# EAGLE design pena (EAGLE 7.7.0)
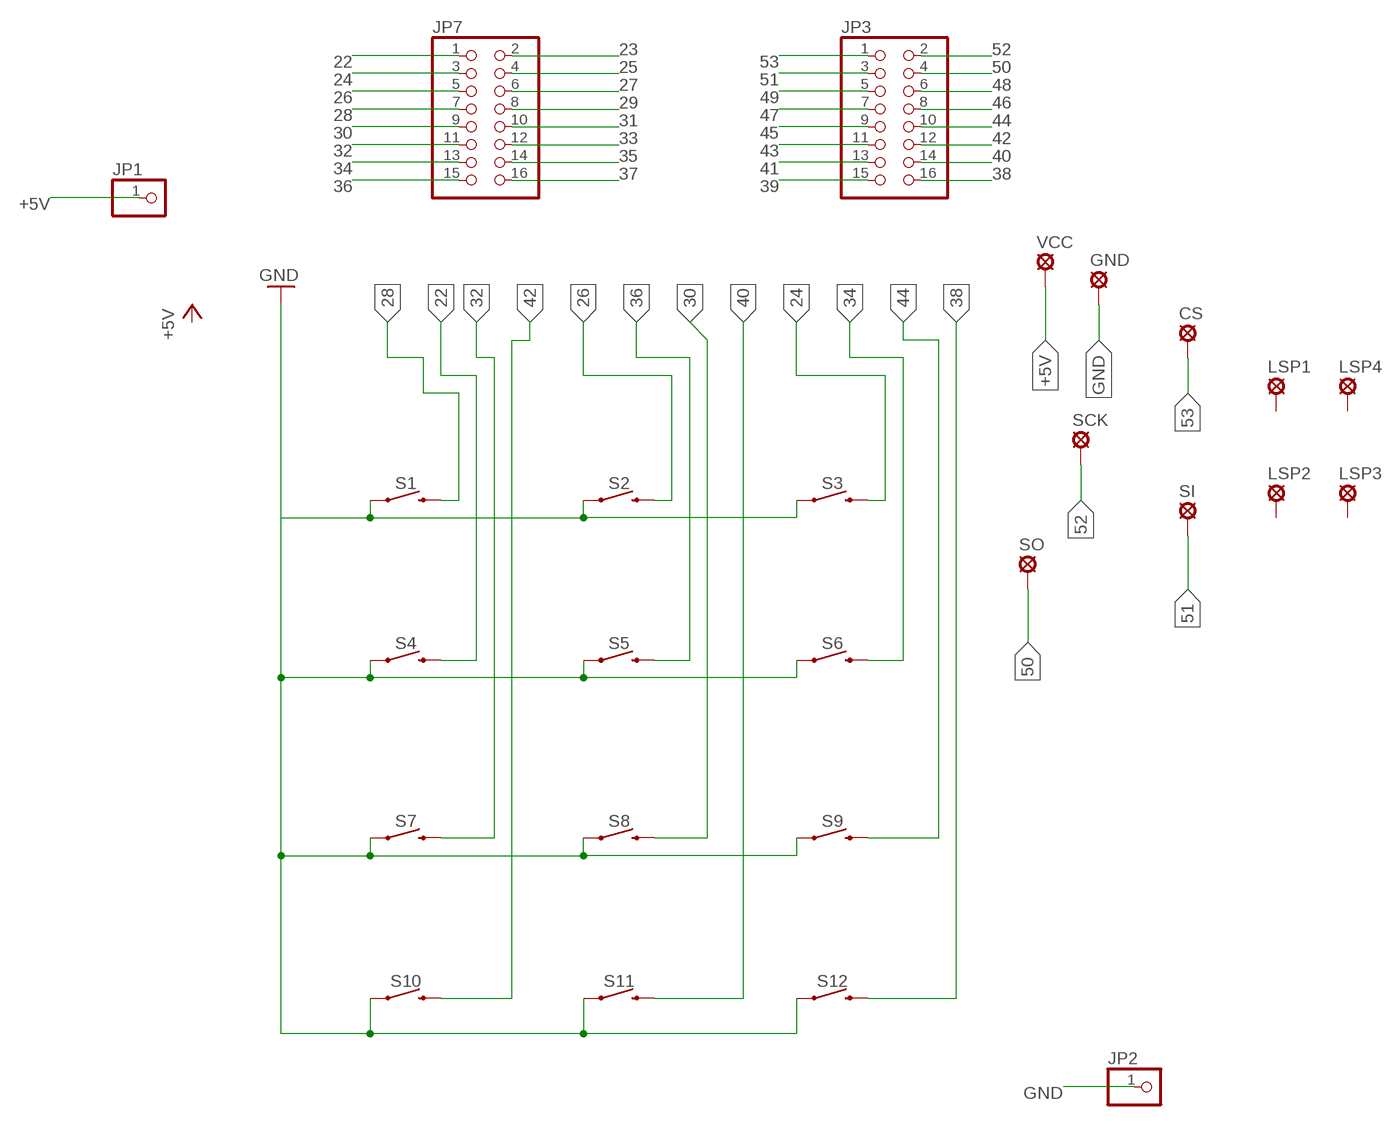
[diagram p0: schematic, sheet 1]

## Parts
CS  SE11  [SE11]
GND  SE11  [SE11]
JP1  PINHD-1X1  [1X01]
JP2  PINHD-1X1  [1X01]
JP3  PINHD-2X8  [2X08]
JP7  PINHD-2X8  [2X08]
LSP1  SE11  [SE11]
LSP2  SE11  [SE11]
LSP3  SE11  [SE11]
LSP4  SE11  [SE11]
S1  MOMENTARY-SWITCH-SPST-PTH-12MM  [TACTILE_SWITCH_PTH_12MM]
S2  MOMENTARY-SWITCH-SPST-PTH-12MM  [TACTILE_SWITCH_PTH_12MM]
S3  MOMENTARY-SWITCH-SPST-PTH-12MM  [TACTILE_SWITCH_PTH_12MM]
S4  MOMENTARY-SWITCH-SPST-PTH-12MM  [TACTILE_SWITCH_PTH_12MM]
S5  MOMENTARY-SWITCH-SPST-PTH-12MM  [TACTILE_SWITCH_PTH_12MM]
S6  MOMENTARY-SWITCH-SPST-PTH-12MM  [TACTILE_SWITCH_PTH_12MM]
S7  MOMENTARY-SWITCH-SPST-PTH-12MM  [TACTILE_SWITCH_PTH_12MM]
S8  MOMENTARY-SWITCH-SPST-PTH-12MM  [TACTILE_SWITCH_PTH_12MM]
S9  MOMENTARY-SWITCH-SPST-PTH-12MM  [TACTILE_SWITCH_PTH_12MM]
S10  MOMENTARY-SWITCH-SPST-PTH-12MM  [TACTILE_SWITCH_PTH_12MM]
S11  MOMENTARY-SWITCH-SPST-PTH-12MM  [TACTILE_SWITCH_PTH_12MM]
S12  MOMENTARY-SWITCH-SPST-PTH-12MM  [TACTILE_SWITCH_PTH_12MM]
SCK  SE11  [SE11]
SI  SE11  [SE11]
SO  SE11  [SE11]
VCC  SE11  [SE11]

## Nets
22: JP7.1 S4.3
23: JP7.2
24: JP7.3 S3.3
25: JP7.4
26: JP7.5 S2.3
27: JP7.6
28: JP7.7 S1.3
29: JP7.8
30: JP7.9 S8.3
31: JP7.10
32: JP7.11 S7.3
33: JP7.12
34: JP7.13 S6.3
35: JP7.14
36: JP7.15 S5.3
37: JP7.16
38: JP3.16 S12.3
39: JP3.15
40: JP3.14 S11.3
41: JP3.13
42: JP3.12 S10.3
43: JP3.11
44: JP3.10 S9.3
45: JP3.9
46: JP3.8
47: JP3.7
48: JP3.6
49: JP3.5
50: JP3.4 SO.MP
51: JP3.3 SI.MP
52: JP3.2 SCK.MP
53: CS.MP JP3.1
+5V: JP1.1 VCC.MP
GND: GND.MP JP2.1 S1.1 S2.1 S3.1 S4.1 S5.1 S6.1 S7.1 S8.1 S9.1 S10.1 S11.1 S12.1
Unconnected: LSP1.MP LSP2.MP LSP3.MP LSP4.MP

## Library data of the parts
CS GND LSP1-LSP4 SCK SI SO VCC = solpad:SE11: SOLDER PAD RTM, drill 1,1mm, distributor Buerklin, 07F810
JP1 JP2 = mega:PINHD-1X1: PIN HEADER
JP3 JP7 = mega:PINHD-2X8: PIN HEADER
S1-S12 = SparkFun-Switches:MOMENTARY-SWITCH-SPST: Momentary Switch (Pushbutton) - SPST Normally-open (NO) SPST momentary switches (buttons, pushbuttons). Variants PTH-12MM - 12mm square, through-hole Momentary Pushbutton Switch - 12mm Square <https://www.sparkfun.com/products/9190> (COM-09190) PTH-6.0MM, PTH-6.0MM-KIT - 6.0mm square, through-hole Mini Pushbutton Switch <https://www.sparkfun.com/products/97> (COM-00097) KIT package intended for soldering kit's - only one side of pads' copper is exposed. PTH-RIGHT-ANGLE-KIT - Right-angle, through-hole Right Angle Tactile Button <https://www.sparkfun.com/products/10791> - Used on SparkFun BigTime Watch Kit <https://www.sparkfun.com/products/11734> SMD-12MM - 12mm square, surface-mount Tactile Button - SMD (12mm) <https://www.sparkfun.com/products/12993> (COM-12993) Used on SparkFun PicoBoard <https://www.sparkfun.com/products/11888> SMD-4.5MM - 4.5mm Square Trackball Switch Used on SparkFun Blackberry Trackballer Breakout <https://www.sparkfun.com/products/13169> SMD-4.6MMX2.8MM - 4.60mm x 2.80mm, surface mount Used on SparkFun SAMD21 Mini Breakout <https://www.sparkfun.com/products/13664> SMD-5.2MM, SMD-5.2-REDUNDANT - 5.2mm square, surface-mount Mini Pushbutton Switch - SMD <https://www.sparkfun.com/products/8720> (COM-08720) Used on Arduino Pro Mini <https://www.sparkfun.com/products/11114> REDUNDANT package connects both switch circuits together SMD-6.0X3.5MM - 6.0 x 3.5mm, surface mount Momentary Reset Switch SMD <https://www.sparkfun.com/products/8229> (COM-08229) SMD-6.2MM-TALL - 6.2mm square, surface mount Tactile Button - SMD (6mm) <https://www.sparkfun.com/products/12992> Used on SparkFun Digital Sandbox <https://www.sparkfun.com/products/12651> SMD-RIGHT-ANGLE - Right-angle, surface mount Used on SparkFun Block for Intel® Edison - Arduino <https://www.sparkfun.com/products/13036>; PROD_ID: SWCH-09185; SF_SKU: COM-09190

## Net classes
0 default: width 1 mm, drill 0.635 mm, clearance 0.25 mm
1 power: width 0.61 mm, drill 0.711 mm, clearance 0.203 mm
2 gnd: width 0.305 mm, drill 0.711 mm, clearance 0.203 mm
3 usbvcc: width 0.508 mm, drill 0.711 mm, clearance 0.203 mm

## Board
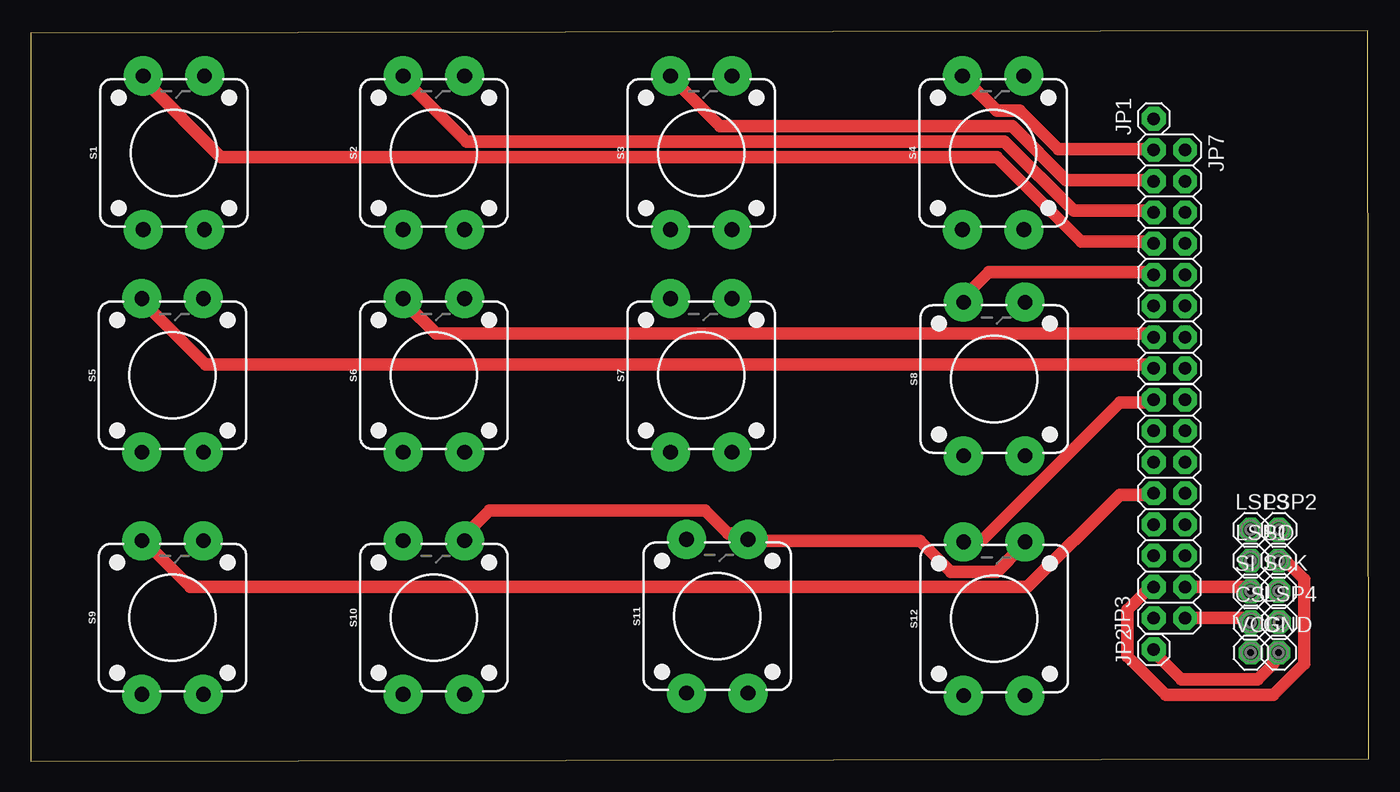
[diagram p1: board, top side]
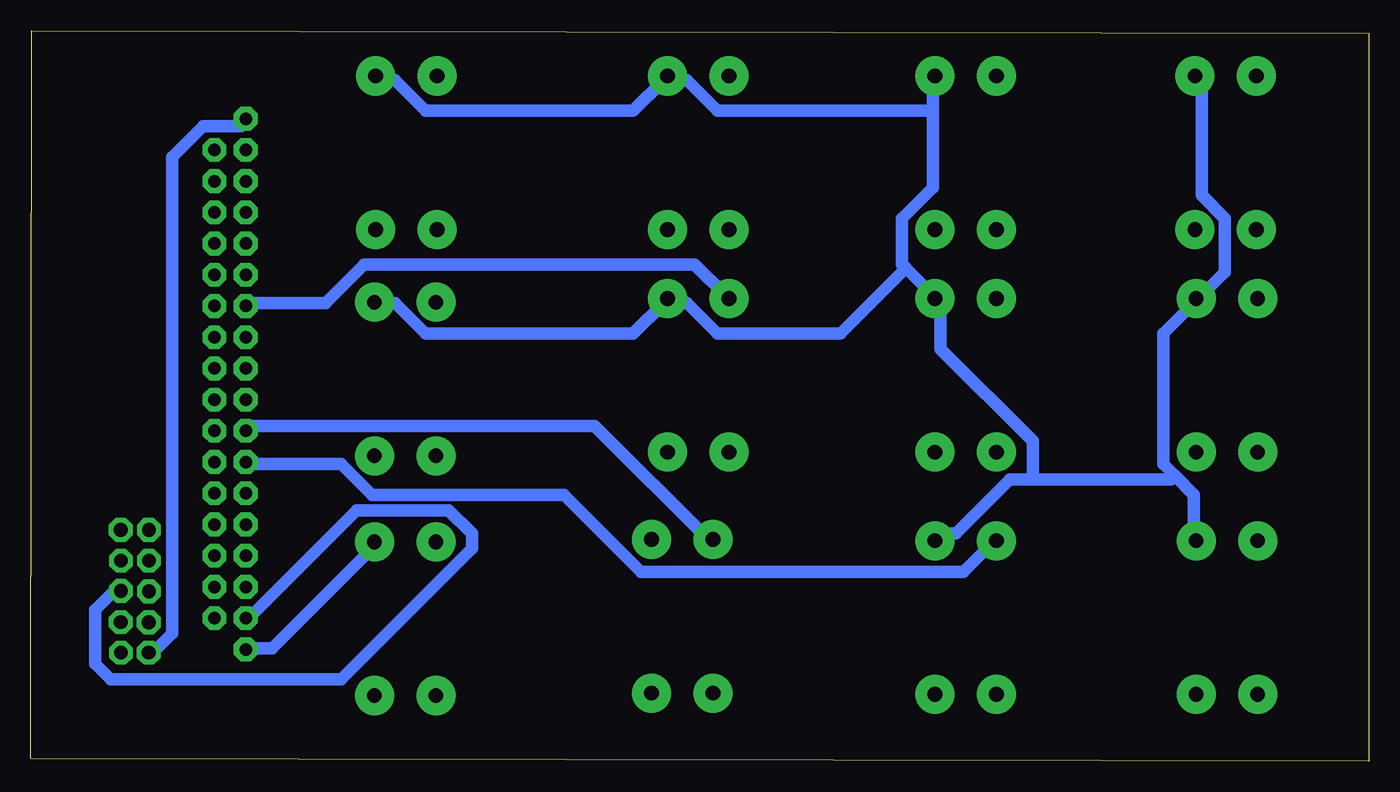
[diagram p2: board, bottom side, seen from below]

Size 108.85 x 59.44 mm. Coordinates in mm from the lower left corner, seen from the top.
Outline: 0,0 108.85,0.2 108.75,59.44 0,59.24 0,0
Copper layers (1*16): Top 0.035mm / dielectric 1.5mm / Bottom 0.035mm
Design rules "default": minimum track width 10mil, minimum drill 24mil, track to track 8mil, track to pad 8mil, pad to pad 8mil, via to via 8mil, smd to smd 8mil, copper to edge 40mil, drill to drill 8mil, minimum pad ring 10mil, minimum via ring 8mil, stop-mask expansion 4mil, vias tented up to drill 0mil, thermal gap 10mil

### Footprints (pad centres in the part's own frame; a part is rotated, then mirrored left to right if it is on the bottom)
SE11 = drill 1.118 pad 1.93 octagon: MP 0,0
1X01 = drill 1.016 pad 1.93 octagon: 1 0,0
2X08 = drill 1.016 pad 1.93 octagon: 1 -8.89,-1.27; 2 -8.89,1.27; 3 -6.35,-1.27; 4 -6.35,1.27; 5 -3.81,-1.27; 6 -3.81,1.27; 7 -1.27,-1.27; 8 -1.27,1.27; 9 1.27,-1.27; 10 1.27,1.27; 11 3.81,-1.27; 12 3.81,1.27; 13 6.35,-1.27; 14 6.35,1.27; 15 8.89,-1.27; 16 8.89,1.27
TACTILE_SWITCH_PTH_12MM = drill 1.2 pad 3.175: 1 6.25,-2.5; 2 -6.25,-2.5; 3 6.25,2.5; 4 -6.25,2.5

### Placement (x,y rotation side)
CS  99.25,11.29 0 top
GND  101.51,8.83 0 top
JP1  91.36,52.28 90 top
JP2  91.36,9.1 90 top
JP3  92.63,20.53 90 top
JP7  92.63,40.85 270 top
LSP1  99.24,16.32 0 top
LSP2  101.54,18.82 0 top
LSP3  99.24,18.82 0 top
LSP4  101.54,11.32 0 top
S1  11.64,49.51 90 top
S2  32.79,49.51 90 top
S3  54.54,49.51 90 top
S4  78.29,49.51 90 top
S5  11.54,31.4 90 top
S6  32.79,31.4 90 top
S7  54.54,31.4 90 top
S8  78.39,31.1 90 top
S9  11.54,11.69 90 top
S10  32.79,11.69 90 top
S11  55.84,11.79 90 top
S12  78.39,11.59 90 top
SCK  101.51,13.85 0 top
SI  99.24,13.82 0 top
SO  101.51,16.31 0 top
VCC  99.25,8.83 0 top

### Tracks (layer width: path | path; a pad name or v marks a point on that pad's centre or on a via)
22
  Top 1: JP7.1 91.09,49.8 83.59,49.8 80.47,52.92 78.59,52.92 76.09,55.42 S4.3
24
  Top 1: JP7.3 91.09,47.3 84.22,47.3 79.84,51.67 56.09,51.67 52.34,55.42 S3.3
26
  Top 1: JP7.5 91.09,44.8 84.84,44.8 79.22,50.42 35.47,50.42 30.46,55.42 S2.3
28
  Top 1: JP7.7 91.09,42.3 85.47,42.3 78.59,49.17 15.46,49.17 9.21,55.42 S1.3
30
  Top 1: JP7.9 91.09,39.8 77.97,39.8 76.09,37.92 S8.3
32
  Bottom 1: JP7.11 91.09,37.3 84.84,37.3 81.72,40.42 54.84,40.42 52.34,37.92 S7.3
34
  Top 1: JP7.13 91.09,34.8 32.97,34.8 30.46,37.3 S6.3
36
  Top 1: JP7.15 91.09,32.3 14.21,32.3 9.21,37.3 S5.3
38
  Top 1: JP3.16 91.09,29.17 88.59,29.17 77.34,17.92 76.09,17.92 S12.3
40
  Bottom 1: JP3.14 91.09,27.3 62.97,27.3 53.59,17.92 S11.3
42
  Bottom 1: JP3.12 91.09,24.17 83.59,24.17 81.09,21.67 65.47,21.67 59.22,15.42 32.97,15.42 30.46,17.92 S10.3
44
  Top 1: JP3.10 91.09,21.67 88.59,21.67 81.09,14.17 12.96,14.17 9.21,17.92 S9.3
50
  Top 1: JP3.4 91.09,14.17 89.22,12.3 89.22,8.55 92.34,5.42 101.09,5.42 103.59,7.92 103.59,14.8 101.72,16.67 SO.MP
51
  Top 1: SI.MP 99.22,14.17 94.22,14.17 JP3.3
52
  Bottom 1: JP3.2 91.09,11.67 82.34,20.42 74.84,20.42 72.97,18.55 72.97,17.3 83.59,6.67 102.34,6.67 103.59,7.92 103.59,12.3 101.72,14.17 SCK.MP
53
  Top 1: CS.MP 99.22,11.67 94.22,11.67 JP3.1
+5V
  Bottom 1: JP1.1 91.72,51.67 94.84,51.67 97.34,49.17 97.34,10.42 99.22,8.55 VCC.MP
GND
  Top 1: GND.MP 101.09,8.55 101.09,7.92 99.84,6.67 93.59,6.67 91.72,8.55 JP2.1 | S12.1 80.47,17.3 78.59,15.42 74.84,15.42 72.34,17.92 58.59,17.92 S11.1 57.97,18.55 56.72,18.55 54.84,20.42 37.34,20.42 35.47,18.55 S10.1
  Bottom 1: JP2.1 91.09,9.17 89.22,9.17 81.09,17.3 S12.1 | 15.78,23.23 16.71,24.17 16.71,34.8 14.21,37.3 S5.1 13.59,37.92 11.71,39.8 11.71,44.17 13.59,46.05 13.59,55.42 S1.1 | 15.78,23.23 14.21,21.67 14.21,18.55 S9.1 | 27.34,22.92 16.09,22.92 15.78,23.23 | 27.34,22.92 29.21,22.92 33.59,18.55 34.84,18.55 S10.1 | 27.34,22.92 27.34,26.05 34.84,33.55 34.84,37.3 S6.1 35.47,37.92 37.65,40.11 | 35.47,52.92 35.47,46.67 37.97,44.17 37.97,40.42 37.65,40.11 | 35.47,52.92 35.47,55.42 S2.1 | 37.65,40.11 42.97,34.8 52.97,34.8 55.47,37.3 56.72,37.3 S7.1 57.34,37.3 59.84,34.8 76.72,34.8 79.22,37.3 80.47,37.3 S8.1 | 35.47,52.92 52.97,52.92 55.47,55.42 56.72,55.42 S3.1 57.34,55.42 59.84,52.92 76.72,52.92 79.22,55.42 80.47,55.42 S4.1